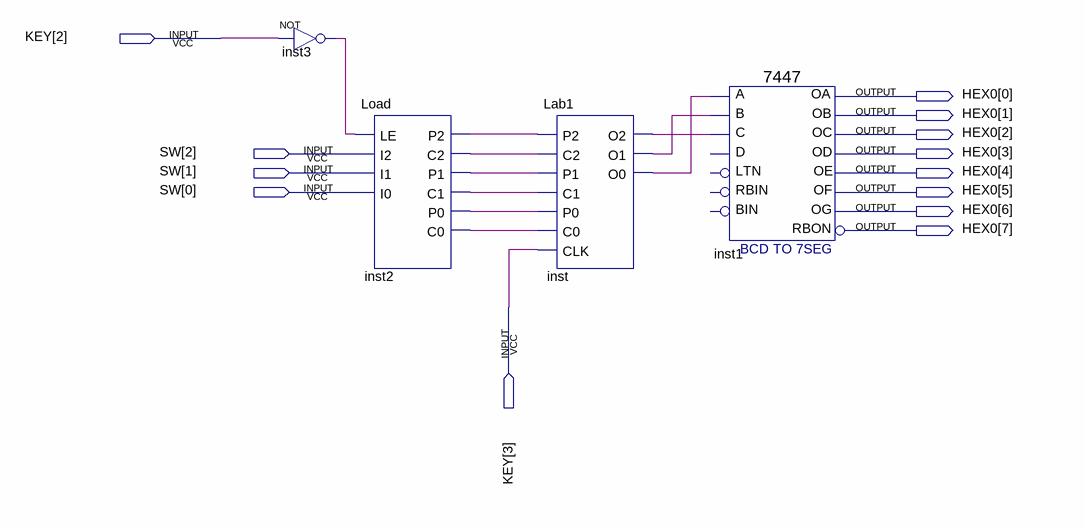
[diagram p0: schematic sheet]
// Quartus schematic Final_Synchronous_Counter_Serial_WithBCD.bdf as structural Verilog: 4 symbols, 13 pins
module Final_Synchronous_Counter_Serial_WithBCD (
  input  [3:2] KEY,
  input  [2:0] SW,
  output [7:0] HEX0
);

  wire inst2_c0, inst2_c1, inst2_c2, inst2_p0, inst2_p1, inst2_p2, inst3_out, inst_o0, inst_o1, inst_o2;

  not inst3 (inst3_out, KEY[2]);
  Load inst2 (
    .LE(inst3_out), .I2(SW[2]), .I1(SW[1]), .I0(SW[0]), .P2(inst2_p2), .C2(inst2_c2), .P1(inst2_p1),
    .C1(inst2_c1), .P0(inst2_p0), .C0(inst2_c0));
  Lab1 inst (
    .P2(inst2_p2), .C2(inst2_c2), .P1(inst2_p1), .C1(inst2_c1), .P0(inst2_p0), .C0(inst2_c0), .CLK(KEY[3]),
    .O2(inst_o2), .O1(inst_o1), .O0(inst_o0));
  \7447  inst1 (
    .B(inst_o1), .C(inst_o2), .A(inst_o0), .OB(HEX0[1]), .OC(HEX0[2]), .OE(HEX0[4]), .OD(HEX0[3]),
    .OF(HEX0[5]), .OG(HEX0[6]), .OA(HEX0[0]), .RBON(HEX0[7]));  // open: LTN, D, RBIN, BIN
endmodule
